# EAGLE design untitled (EAGLE 7.2.0)
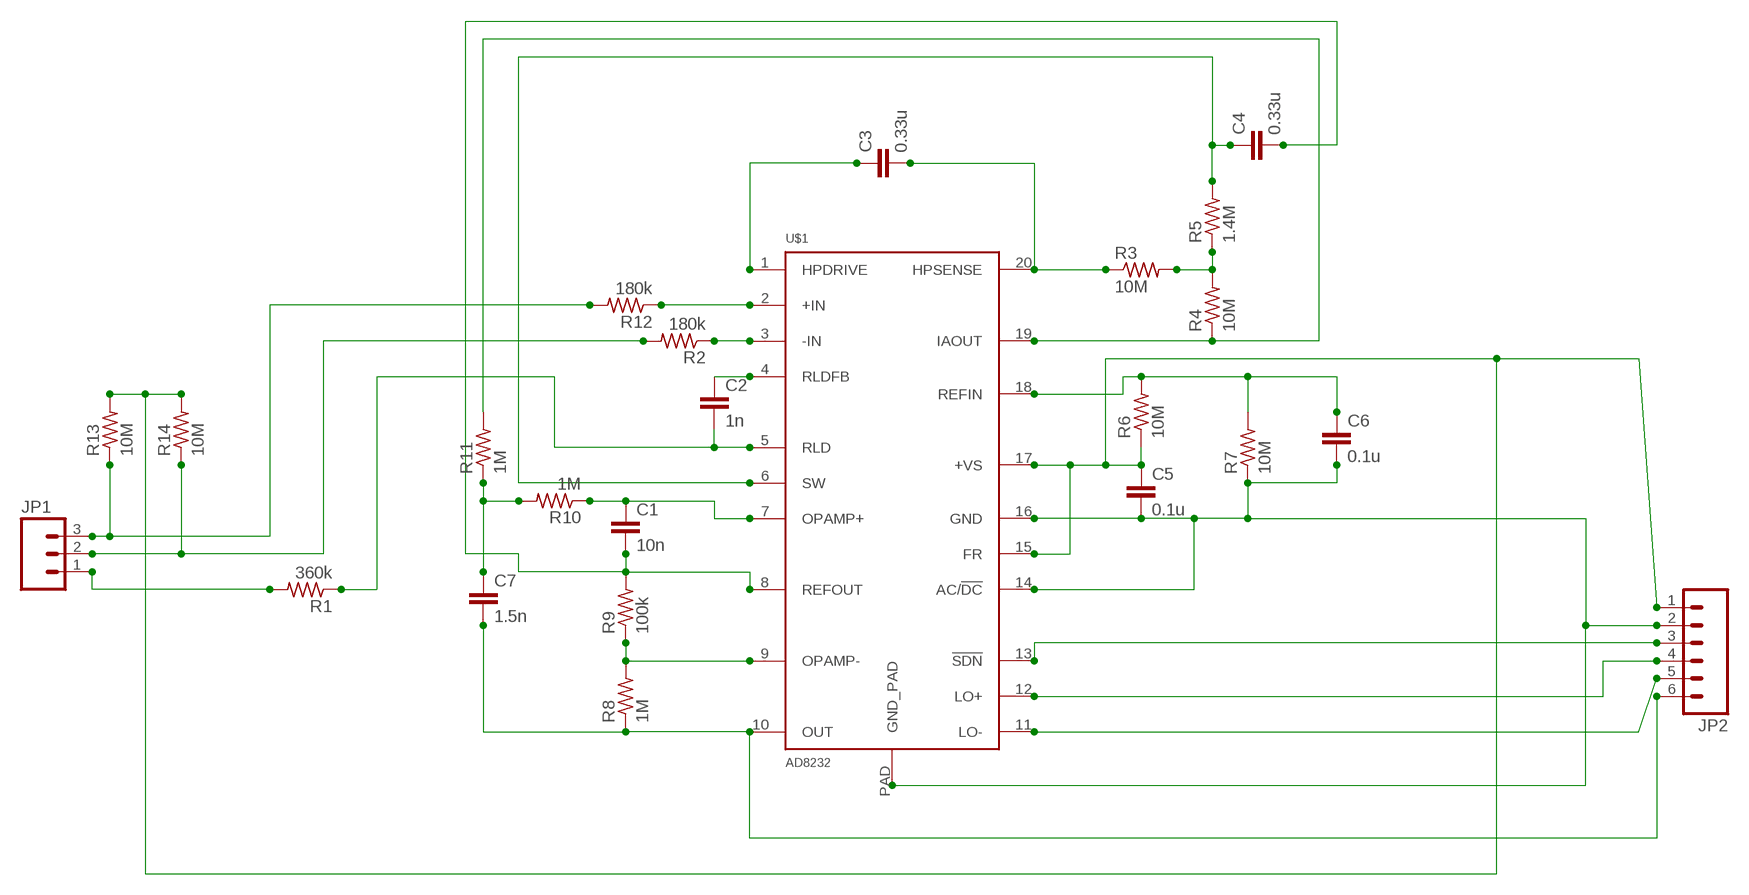
[diagram p0: schematic, sheet 1]

## Parts
C1  10n  C-EUC0603  [C0603]
C2  1n  C-EUC0603  [C0603]
C3  0.33u  C-EUC0603  [C0603]
C4  0.33u  C-EUC0603  [C0603]
C5  0.1u  C-EUC0603  [C0603]
C6  0.1u  C-EUC0603  [C0603]
C7  1.5n  C-EUC0603  [C0603]
JP1  M03PTH  [1X03]
JP2  M06SILK_FEMALE_PTH  [1X06]
R1  360k  R-US_R0603  [R0603]
R2  180k  R-US_R0603  [R0603]
R3  10M  R-US_R0603  [R0603]
R4  10M  R-US_R0603  [R0603]
R5  1.4M  R-US_R0603  [R0603]
R6  10M  R-US_R0603  [R0603]
R7  10M  R-US_R0603  [R0603]
R8  1M  R-US_R0603  [R0603]
R9  100k  R-US_R0603  [R0603]
R10  1M  R-US_R0603  [R0603]
R11  1M  R-US_R0603  [R0603]
R12  180k  R-US_R0603  [R0603]
R13  10M  R-US_R0603  [R0603]
R14  10M  R-US_R0603  [R0603]
U$1  AD8232  [LFCSP_20]

## Nets
N$1: C3.1 U$1.1(HPDRIVE)
N$2: C3.2 R3.1 U$1.20(HPSENSE)
N$3: R3.2 R4.2 R5.1
N$4: C4.1 R5.2 U$1.6(SW)
N$5: R4.1 R11.2 U$1.19(IAOUT)
N$6: C6.1 R6.2 R7.2 U$1.18(REFIN)
N$8: JP2.5 U$1.11(LO-)
N$9: C5.2 C6.2 JP2.2 R7.1 U$1.14(AC/!DC) U$1.16(GND) U$1.PAD(GND_PAD)
N$10: JP2.4 U$1.12(LO+)
N$11: JP2.3 U$1.13(!SDN)
N$12: C7.2 JP2.6 R8.1 U$1.10(OUT)
N$13: C7.1 R10.2 R11.1
N$14: C1.1 R10.1 U$1.7(OPAMP+)
N$15: C1.2 C4.2 R9.2 U$1.8(REFOUT)
N$16: R8.2 R9.1 U$1.9(OPAMP-)
N$20: C2.1 U$1.4(RLDFB)
N$22: JP1.1 R1.2
N$23: R2.1 U$1.3(-IN)
N$24: R12.1 U$1.2(+IN)
N$25: JP1.3 R12.2 R13.1
N$26: JP1.2 R2.2 R14.1
N$27: C5.1 JP2.1 R6.1 R13.2 R14.2 U$1.15(FR) U$1.17(+VS)
N$28: C2.2 R1.1 U$1.5(RLD)

## Library data of the parts
C1-C7 = resistor:C-EU: CAPACITOR, European symbol
JP1 = SparkFun-Connectors:M03: Header 3 Standard 3-pin 0.1" header. Use with straight break away headers (SKU : PRT-00116), right angle break away headers (PRT-00553), swiss pins (PRT-00743), machine pins (PRT-00117), and female headers (PRT-00115). Molex polarized connector foot print use with SKU : PRT-08232 with associated crimp pins and housings.
JP2 = SparkFun-Connectors:M06: Header 6 Standard 6-pin 0.1" header. Use with straight break away headers (SKU : PRT-00116), right angle break away headers (PRT-00553), swiss pins (PRT-00743), machine pins (PRT-00117), and female headers (PRT-00115). Molex polarized connector foot print use with SKU : PRT-08094 with associated crimp pins and housings. NOTES ON THE VARIANTS LOCK and LOCK_LONGPADS... This footprint was designed to help hold the alignment of a through-hole component (i.e. 6-pin header) while soldering it into place. You may notice that each hole has been shifted either up or down by 0.005 of an inch from it's more standard position (which is a perfectly straight line). This slight alteration caused the pins (the squares in the middle) to touch the edges of the holes. Because they are alternating, it causes a "brace" to hold the component in place. 0.005 has proven to be the perfect amount of "off-center" position when using our standard breakaway headers. Although looks a little odd when you look at the bare footprint, once you have a header in there, the alteration is very hard to notice. Also,if you push a header all the way into place, it is covered up entirely on the bottom side. This idea of altering the position of holes to aid alignment will be further integrated into the Sparkfun Library for other footprints. It can help hold any component with 3 or more connection pins.; PROD_ID: CONN-08437
R1-R14 = resistor:R-US_: RESISTOR, American symbol
U$1 = SparkFun-AnalogIC:AD8232; PROD_ID: IC-11886

## Board
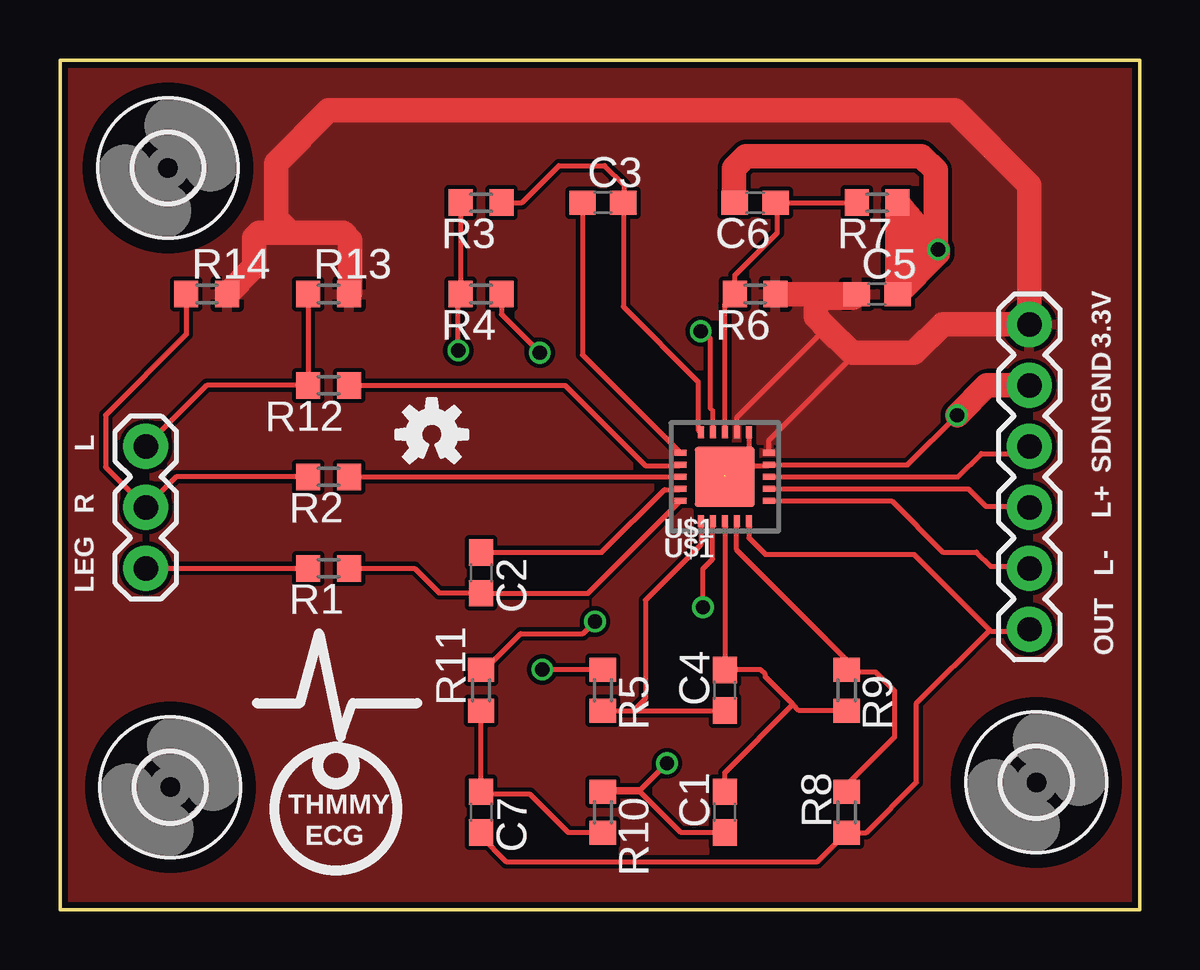
[diagram p1: board, top side]
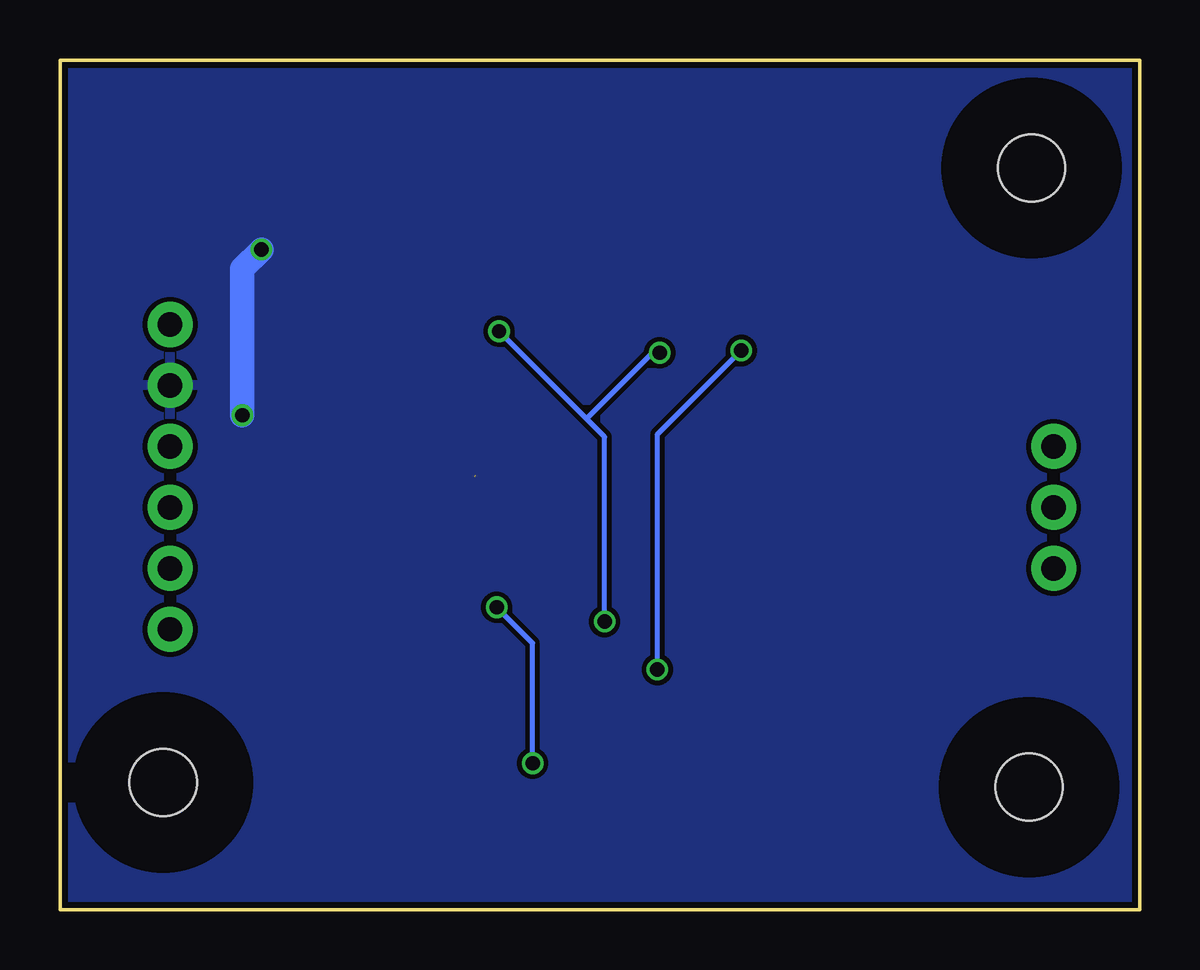
[diagram p2: board, bottom side, seen from below]

Size 45 x 35.4 mm. Coordinates in mm from the lower left corner, seen from the top.
Outline: 0,35.4 45,35.4 45,0 0,0 0,35.4
Copper layers (1*16): Top 0.018mm / dielectric 1.55mm / Bottom 0.018mm
Design rules "untitled *": minimum track width 0.203mm, minimum drill 0.35mm, track to track 0.18mm, track to pad 0.18mm, pad to pad 0.18mm, via to via 0.18mm, smd to smd 0mil, copper to edge 0.25mm, drill to drill 0.35mm, minimum pad ring 0.175mm, minimum via ring 0.125mm, stop-mask expansion 0mil, vias tented up to drill 0.45mm, thermal gap 0.2mm

### Footprints (pad centres in the part's own frame; a part is rotated, then mirrored left to right if it is on the bottom)
C0603 = smd 1.1 x 1: 1 -0.85,0; 2 0.85,0
1X03 = drill 1.016 pad 1.88: 1 0,0; 2 2.54,0; 3 5.08,0
1X06 = drill 1.016 pad 1.88: 1 0,0; 2 2.54,0; 3 5.08,0; 4 7.62,0; 5 10.16,0; 6 12.7,0
R0603 = smd 1 x 1.1: 1 -0.85,0; 2 0.85,0
LFCSP_20 = smd 0.5 x 0.25: 1 -1.85,1; 2 -1.85,0.5; 3 -1.85,0; 4 -1.85,-0.5; 5 -1.85,-1; 11 1.85,-1; 12 1.85,-0.5; 13 1.85,0; 14 1.85,0.5; 15 1.85,1 | smd 0.25 x 0.5: 6 -1,-1.85; 7 -0.5,-1.85; 8 0,-1.85; 9 0.5,-1.85; 10 1,-1.85; 16 1,1.85; 17 0.5,1.85; 18 0,1.85; 19 -0.5,1.85; 20 -1,1.85 | smd 2.5 x 2.5: PAD 0,0
2,8 = hole 2.8: 0,0

### Placement (x,y rotation side)
C1  27.71,4.06 90 top
C2  17.55,14.03 270 top
C3  22.63,29.46 0 top
C4  27.71,9.14 90 top
C5  34.06,25.65 0 top
C6  28.98,29.46 180 top
C7  17.55,4.06 270 top
JP1  3.58,14.22 90 top
JP2  40.41,24.38 270 top
R1  11.2,14.22 180 top
R2  11.2,18.03 180 top
R3  17.55,29.46 180 top
R4  17.55,25.65 180 top
R5  22.63,9.14 270 top
R6  28.98,25.65 180 top
R7  34.06,29.46 180 top
R8  32.79,4.06 90 top
R9  32.79,9.14 270 top
R10  22.63,4.06 270 top
R11  17.55,9.14 90 top
R12  11.2,21.84 180 top
R13  11.2,25.65 0 top
R14  6.12,25.65 0 top
U$1  27.71,18.03 0 top
U$2  [2,8]  4.5,30.9 0 top
U$3  [2,8]  4.6,5.1 0 top
U$4  [2,8]  40.7,5.3 0 top
U$6  [OSHW-LOGO-S]  15.5,19.8 0 top

### Tracks (layer width: path | path; a pad name or v marks a point on that pad's centre or on a via)
N$1
  Top 0.204: C3.1 21.78,23.11 U$1.1
N$2
  Top 0.204: U$1.20 26.6,19.99 26.6,22 23.48,25.12 C3.2 23.5,29.48 23.5,30.2 22.7,31 20.8,31 19.26,29.46 R3.1
N$3  (via drill 0.6)
  Top 0.204: R5.1 v20.11,9.99 v20.1,10 | v16.6,23.3 16.6,25.55 R4.2 R3.2
  Bottom 0.204: v20.1,10 20.1,19.8 v16.6,23.3
N$4
  Top 0.204: R5.2 23.9,8.29 | 23.9,8.29 C4.1 | U$1.6 26.71,15.21 24.4,12.9 24.4,8.79 23.9,8.29
N$5  (via drill 0.6)
  Top 0.204: R11.2 17.69,9.99 19.2,11.5 21.8,11.5 v22.3,12 | v26.7,24.1 26.8,24.1 27.1,23.8 27.1,20.9 27.2,20.8 U$1.19 | R4.1 18.4,24.8 v20,23.2
  Bottom 0.204: v22.3,12 22.3,19.7 23.05,20.45 | 23.05,20.45 v26.7,24.1 | v20,23.2 20.3,23.2 23.05,20.45
N$6
  Top 0.204: U$1.18 27.71,25.23 R6.2 28.13,26.43 29.9,28.2 29.9,29.39 C6.1 R7.2
N$8
  Top 0.204: U$1.11 34.67,17.03 36.8,14.9 38.2,14.9 38.8,14.3 40.33,14.3 JP2.5
N$9  (via drill 0.6)  (1 unrouted)
  Top 0.204: U$1.16 28.71,18.81 28.7,18.8 | 28.7,18.8 28.4,18.5 | 28.4,18.5 29.53,18.5 U$1.14 35.33,18.53 v37.4,20.6 | 27.7,18.1 27.8,18.1 | 28.3,18.4 28.4,18.5 | 28.7,18.8 28.6,18.8 27.6,17.8 27.6,17.9 27.8,18.1 | 27.8,18.1 28,18.1 28.3,18.4 | 28.3,18.4 28.5,18.4 | 28.3,18.4 28.1,18.4
  Top 1.016: JP2.2 38.64,21.84 v37.4,20.6 | v36.6,27.5 36.6,27.34 C5.2 R7.1 35.71,28.49 36.4,27.6 | 36.4,27.5 36.4,27.6 | 36.4,27.6 35.6,27.6 35.5,27.5 35.5,27.2 35.6,27.1 36.5,27.6 36.5,30.8 35.9,31.4 28.6,31.4 28.1,30.9 28.1,29.49 C6.2
  Bottom 1.016: v37.4,20.6 37.4,26.7 v36.6,27.5
  pour Bottom (isolate 0.2): 0,35.4 0,0 45,0 45,35.4
N$10
  Top 0.204: U$1.12 37.87,17.53 38.6,16.8 40.37,16.8 JP2.4
N$11
  Top 0.204: U$1.13 37.43,18.03 38.4,19 40.11,19 JP2.3
N$12
  Top 0.204: U$1.10 28.71,15.49 29.4,14.8 35.6,14.8 38.75,11.65 | 38.75,11.65 38.8,11.6 40.33,11.6 JP2.6 | 38.75,11.65 35.7,8.6 35.7,5.3 33.61,3.21 R8.1 31.58,2 18.6,2 17.55,3.05 C7.2
N$13
  Top 0.204: R10.2 21.19,3.21 19.6,4.8 17.66,4.8 C7.1 R11.1
N$14  (via drill 0.6)
  Top 0.204: C1.1 25.89,3.21 24.1,5 22.72,5 R10.1 24.11,4.91 v25.3,6.1 | v26.8,12.6 26.8,14.2 27.2,14.6 U$1.7
  Bottom 0.204: v25.3,6.1 25.3,11.1 v26.8,12.6
N$15
  Top 0.204: R9.2 30.81,8.29 30.55,8.55 | 30.55,8.55 29.4,9.7 29.4,9.8 29.2,10 C4.2 U$1.8 | C1.2 27.71,5.71 30.55,8.55
N$16
  Top 0.204: R8.2 32.79,5.19 34.8,7.2 34.8,9.1 34,9.9 32.88,9.9 R9.1 32.79,10.41 28.2,15 U$1.9
N$20
  Top 0.204: C2.1 22.58,14.88 25.2,17.5 25.83,17.5 U$1.4
N$22
  Top 0.204: JP1.1 R1.2
N$23
  Top 0.204: R2.1 U$1.3
N$24
  Top 0.204: R12.1 21.06,21.84 24.4,18.5 25.83,18.5 U$1.2
N$25
  Top 0.204: JP1.3 6.12,21.84 R12.2 R13.1
N$26
  Top 0.204: R2.2 4.85,18.03 JP1.2 1.9,18.44 1.9,20.6 5.27,23.97 R14.1
N$27
  Top 0.204: U$1.17 28.21,20.51 31.95,24.25 | U$1.15 29.56,19.56 33.2,23.2
  Top 1.016: 9.6,28.2 9,28.8 9,31.1 11.2,33.3 37.3,33.3 40.41,30.19 JP2.1 40.41,24.4 36.8,24.4 35.6,23.2 33.2,23.2 33,23.2 31.95,24.25 31.5,24.7 31.5,25.4 31.6,25.5 33.06,25.5 C5.1 R6.1 | 9.6,28.2 11.8,28.2 12.1,27.9 12.1,25.7 R13.2 | 9.6,28.2 8.3,28.2 8.1,28 8.1,26.78 R14.2
  pour Top: 0,35.4 45,35.4 45,0 0,0
N$28
  Top 0.204: U$1.5 22.01,13.18 C2.2 17.53,13.2 15.8,13.2 14.78,14.22 R1.1

### Text on the board
tPlace: 3.3V | GND | L | SDN | R | L+ | L- | LEG | OUT | THMMY | ECG
_tNames: C3 | R3 | C6 | R7 | R14 | R13 | C5 | R4 | R6 | R12 | R2 | U$1 | C2 | R1 | R5 | R9 | R11 | C4 | C7 | R10 | THMMY | C1 | R8 | ECG